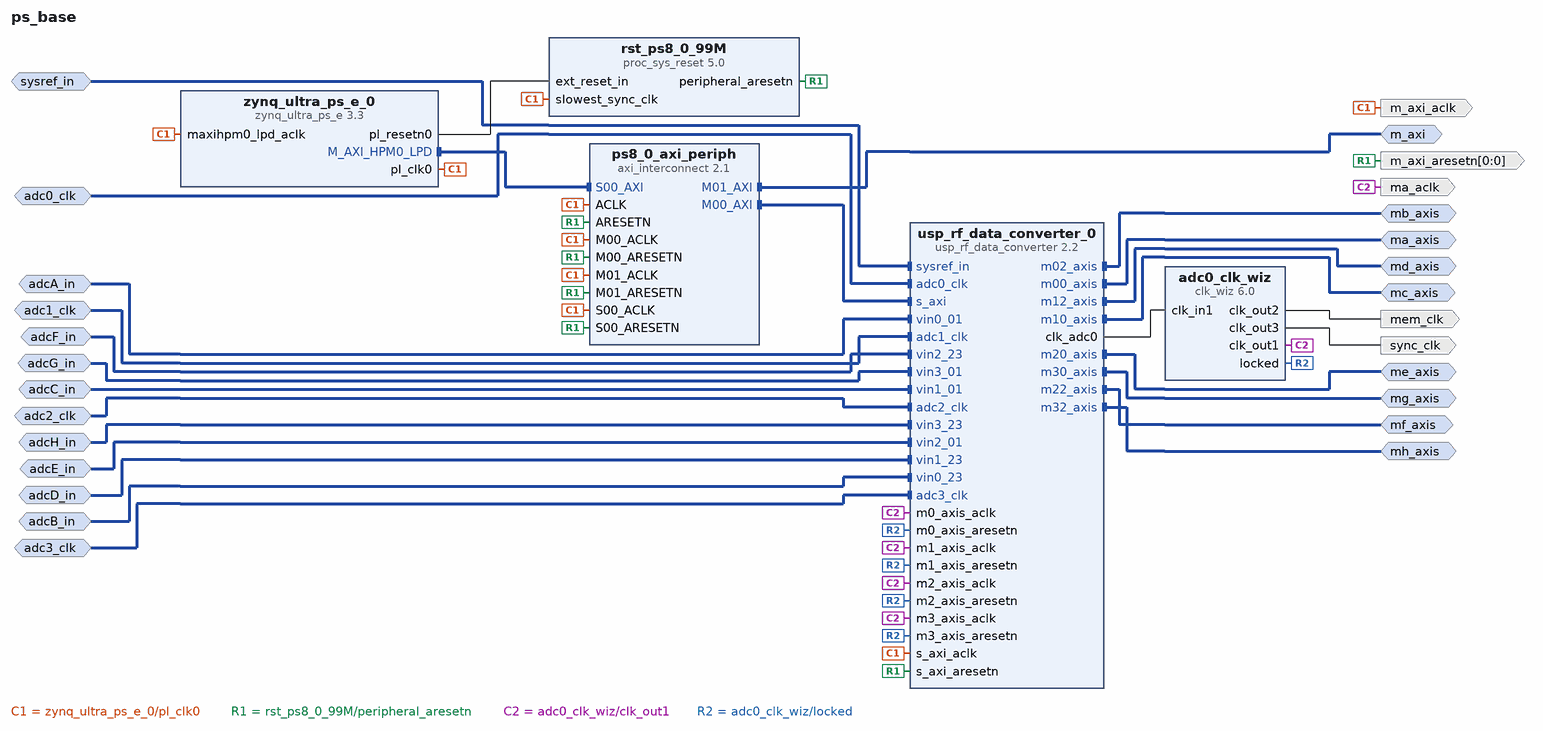
[diagram p0: block diagram of the top level]
# Vivado block design ps_base, xczu25dr-ffve1156-1-e, Vivado 2019.2
create_bd_design ps_base

create_bd_intf_port -mode Slave -vlnv xilinx.com:interface:diff_analog_io_rtl:1.0 adcA_in
create_bd_intf_port -mode Master -vlnv xilinx.com:interface:axis_rtl:1.0 ma_axis
create_bd_intf_port -mode Slave -vlnv xilinx.com:display_usp_rf_data_converter:diff_pins_rtl:1.0 sysref_in
create_bd_intf_port -mode Slave -vlnv xilinx.com:interface:diff_clock_rtl:1.0 adc0_clk
set_property -dict {CONFIG.FREQ_HZ 245760000.0} [get_bd_intf_ports adc0_clk]
create_bd_intf_port -mode Master -vlnv xilinx.com:interface:axis_rtl:1.0 mb_axis
create_bd_intf_port -mode Master -vlnv xilinx.com:interface:axis_rtl:1.0 mc_axis
create_bd_intf_port -mode Master -vlnv xilinx.com:interface:axis_rtl:1.0 md_axis
create_bd_intf_port -mode Master -vlnv xilinx.com:interface:axis_rtl:1.0 me_axis
create_bd_intf_port -mode Master -vlnv xilinx.com:interface:axis_rtl:1.0 mf_axis
create_bd_intf_port -mode Master -vlnv xilinx.com:interface:axis_rtl:1.0 mg_axis
create_bd_intf_port -mode Master -vlnv xilinx.com:interface:axis_rtl:1.0 mh_axis
create_bd_intf_port -mode Slave -vlnv xilinx.com:interface:diff_clock_rtl:1.0 adc1_clk
create_bd_intf_port -mode Slave -vlnv xilinx.com:interface:diff_clock_rtl:1.0 adc2_clk
create_bd_intf_port -mode Slave -vlnv xilinx.com:interface:diff_clock_rtl:1.0 adc3_clk
create_bd_intf_port -mode Slave -vlnv xilinx.com:interface:diff_analog_io_rtl:1.0 adcB_in
create_bd_intf_port -mode Slave -vlnv xilinx.com:interface:diff_analog_io_rtl:1.0 adcC_in
create_bd_intf_port -mode Slave -vlnv xilinx.com:interface:diff_analog_io_rtl:1.0 adcD_in
create_bd_intf_port -mode Slave -vlnv xilinx.com:interface:diff_analog_io_rtl:1.0 adcE_in
create_bd_intf_port -mode Slave -vlnv xilinx.com:interface:diff_analog_io_rtl:1.0 adcF_in
create_bd_intf_port -mode Slave -vlnv xilinx.com:interface:diff_analog_io_rtl:1.0 adcG_in
create_bd_intf_port -mode Slave -vlnv xilinx.com:interface:diff_analog_io_rtl:1.0 adcH_in
create_bd_intf_port -mode Master -vlnv xilinx.com:interface:aximm_rtl:1.0 m_axi
set_property -dict [list \
  CONFIG.DATA_WIDTH 32 \
  CONFIG.PROTOCOL AXI4LITE \
  CONFIG.ADDR_WIDTH 32 \
  CONFIG.HAS_BURST 0 \
  CONFIG.HAS_LOCK 0 \
  CONFIG.HAS_PROT 0 \
  CONFIG.HAS_CACHE 0 \
  CONFIG.HAS_QOS 0 \
  CONFIG.HAS_REGION 0 \
  CONFIG.NUM_READ_OUTSTANDING 1 \
  CONFIG.NUM_WRITE_OUTSTANDING 1 \
] [get_bd_intf_ports m_axi]
create_bd_port -dir O -type clk ma_aclk
set_property -dict [list \
  CONFIG.ASSOCIATED_BUSIF ma_axis:mb_axis:mc_axis:md_axis:me_axis:mf_axis:mg_axis:mh_axis \
] [get_bd_ports ma_aclk]
create_bd_port -dir O -type clk m_axi_aclk
set_property -dict {CONFIG.ASSOCIATED_BUSIF m_axi} [get_bd_ports m_axi_aclk]
create_bd_port -dir O -from 0 -to 0 -type rst m_axi_aresetn
create_bd_port -dir O -type clk mem_clk
set_property -dict {CONFIG.FREQ_HZ 491520000} [get_bd_ports mem_clk]
create_bd_port -dir O -type clk sync_clk
set_property -dict {CONFIG.FREQ_HZ 122880000} [get_bd_ports sync_clk]

create_bd_cell -type ip -vlnv xilinx.com:ip:zynq_ultra_ps_e:3.3 zynq_ultra_ps_e_0
set_property -dict [list \
  CONFIG.PSU_BANK_0_IO_STANDARD LVCMOS18 \
  CONFIG.PSU_BANK_1_IO_STANDARD LVCMOS18 \
  CONFIG.PSU_BANK_2_IO_STANDARD LVCMOS18 \
  CONFIG.PSU_BANK_3_IO_STANDARD LVCMOS18 \
  CONFIG.PSU_USB3__DUAL_CLOCK_ENABLE 1 \
  CONFIG.PSU__CRF_APB__DDR_CTRL__FREQMHZ 1200 \
  CONFIG.PSU__CRL_APB__PL1_REF_CTRL__FREQMHZ 500 \
  CONFIG.PSU__DDRC__DEVICE_CAPACITY {8192 MBits} \
  CONFIG.PSU__DDRC__DRAM_WIDTH {16 Bits} \
  CONFIG.PSU__DDRC__SPEED_BIN DDR4_2400P \
  CONFIG.PSU__DDR_HIGH_ADDRESS_GUI_ENABLE 1 \
  CONFIG.PSU__DDR__INTERFACE__FREQMHZ 600.000 \
  CONFIG.PSU__DLL__ISUSED 1 \
  CONFIG.PSU__ENET3__FIFO__ENABLE 0 \
  CONFIG.PSU__ENET3__GRP_MDIO__ENABLE 1 \
  CONFIG.PSU__ENET3__GRP_MDIO__IO {MIO 76 .. 77} \
  CONFIG.PSU__ENET3__PERIPHERAL__ENABLE 1 \
  CONFIG.PSU__ENET3__PERIPHERAL__IO {MIO 64 .. 75} \
  CONFIG.PSU__ENET3__PTP__ENABLE 0 \
  CONFIG.PSU__ENET3__TSU__ENABLE 0 \
  CONFIG.PSU__FPGA_PL1_ENABLE 1 \
  CONFIG.PSU__GEM3_COHERENCY 0 \
  CONFIG.PSU__GEM3_ROUTE_THROUGH_FPD 0 \
  CONFIG.PSU__GEM__TSU__ENABLE 0 \
  CONFIG.PSU__GPIO0_MIO__IO {MIO 0 .. 25} \
  CONFIG.PSU__GPIO0_MIO__PERIPHERAL__ENABLE 1 \
  CONFIG.PSU__GPIO1_MIO__IO {MIO 26 .. 51} \
  CONFIG.PSU__GPIO1_MIO__PERIPHERAL__ENABLE 1 \
  CONFIG.PSU__GPIO2_MIO__IO {MIO 52 .. 77} \
  CONFIG.PSU__GPIO2_MIO__PERIPHERAL__ENABLE 1 \
  CONFIG.PSU__I2C0__PERIPHERAL__ENABLE 1 \
  CONFIG.PSU__I2C0__PERIPHERAL__IO {MIO 14 .. 15} \
  CONFIG.PSU__I2C1__PERIPHERAL__ENABLE 1 \
  CONFIG.PSU__I2C1__PERIPHERAL__IO {MIO 32 .. 33} \
  CONFIG.PSU__PCIE__BAR0_ENABLE 1 \
  CONFIG.PSU__PCIE__BAR0_SCALE Megabytes \
  CONFIG.PSU__PCIE__BAR0_SIZE 1 \
  CONFIG.PSU__PCIE__BAR0_TYPE Memory \
  CONFIG.PSU__PCIE__BAR0_VAL 0xfff00000 \
  CONFIG.PSU__PCIE__BAR1_VAL 0x0 \
  CONFIG.PSU__PCIE__BAR2_VAL 0x0 \
  CONFIG.PSU__PCIE__BAR3_VAL 0x0 \
  CONFIG.PSU__PCIE__BAR4_VAL 0x0 \
  CONFIG.PSU__PCIE__BAR5_VAL 0x0 \
  CONFIG.PSU__PCIE__BRIDGE_BAR_INDICATOR {BAR 0} \
  CONFIG.PSU__PCIE__CLASS_CODE_BASE 0x05 \
  CONFIG.PSU__PCIE__CLASS_CODE_INTERFACE 0x0 \
  CONFIG.PSU__PCIE__CLASS_CODE_SUB 0x80 \
  CONFIG.PSU__PCIE__CLASS_CODE_VALUE 0x58000 \
  CONFIG.PSU__PCIE__DEVICE_ID 0xD011 \
  CONFIG.PSU__PCIE__DEVICE_PORT_TYPE {Endpoint Device} \
  CONFIG.PSU__PCIE__EROM_VAL 0x0 \
  CONFIG.PSU__PCIE__INTX_GENERATION 1 \
  CONFIG.PSU__PCIE__INTX_PIN INTA \
  CONFIG.PSU__PCIE__LANE0__ENABLE 1 \
  CONFIG.PSU__PCIE__LANE0__IO {GT Lane0} \
  CONFIG.PSU__PCIE__LANE1__ENABLE 1 \
  CONFIG.PSU__PCIE__LANE1__IO {GT Lane1} \
  CONFIG.PSU__PCIE__LANE2__ENABLE 1 \
  CONFIG.PSU__PCIE__LANE2__IO {GT Lane2} \
  CONFIG.PSU__PCIE__LANE3__ENABLE 1 \
  CONFIG.PSU__PCIE__LANE3__IO {GT Lane3} \
  CONFIG.PSU__PCIE__LINK_SPEED {5.0 Gb/s} \
  CONFIG.PSU__PCIE__MAXIMUM_LINK_WIDTH x4 \
  CONFIG.PSU__PCIE__MAX_PAYLOAD_SIZE {256 bytes} \
  CONFIG.PSU__PCIE__MSIX_BAR_INDICATOR {BAR 0} \
  CONFIG.PSU__PCIE__MSIX_PBA_BAR_INDICATOR {BAR 0} \
  CONFIG.PSU__PCIE__PERIPHERAL__ENABLE 1 \
  CONFIG.PSU__PCIE__PERIPHERAL__ENDPOINT_IO {MIO 35} \
  CONFIG.PSU__PCIE__REF_CLK_FREQ 100 \
  CONFIG.PSU__PCIE__REF_CLK_SEL {Ref Clk0} \
  CONFIG.PSU__PCIE__REVISION_ID 0x0 \
  CONFIG.PSU__PCIE__SUBSYSTEM_ID 0x7 \
  CONFIG.PSU__PCIE__SUBSYSTEM_VENDOR_ID 0x10EE \
  CONFIG.PSU__PCIE__VENDOR_ID 0x10EE \
  CONFIG.PSU__PRESET_APPLIED 1 \
  CONFIG.PSU__PSS_REF_CLK__FREQMHZ 33.333333 \
  CONFIG.PSU__QSPI_COHERENCY 0 \
  CONFIG.PSU__QSPI_ROUTE_THROUGH_FPD 0 \
  CONFIG.PSU__QSPI__GRP_FBCLK__ENABLE 1 \
  CONFIG.PSU__QSPI__GRP_FBCLK__IO {MIO 6} \
  CONFIG.PSU__QSPI__PERIPHERAL__DATA_MODE x4 \
  CONFIG.PSU__QSPI__PERIPHERAL__ENABLE 1 \
  CONFIG.PSU__QSPI__PERIPHERAL__IO {MIO 0 .. 12} \
  CONFIG.PSU__QSPI__PERIPHERAL__MODE {Dual Parallel} \
  CONFIG.PSU__SD1_COHERENCY 0 \
  CONFIG.PSU__SD1_ROUTE_THROUGH_FPD 0 \
  CONFIG.PSU__SD1__DATA_TRANSFER_MODE 4Bit \
  CONFIG.PSU__SD1__GRP_CD__ENABLE 0 \
  CONFIG.PSU__SD1__GRP_POW__ENABLE 0 \
  CONFIG.PSU__SD1__GRP_WP__ENABLE 0 \
  CONFIG.PSU__SD1__PERIPHERAL__ENABLE 1 \
  CONFIG.PSU__SD1__PERIPHERAL__IO {MIO 46 .. 51} \
  CONFIG.PSU__SD1__SLOT_TYPE {SD 2.0} \
  CONFIG.PSU__SWDT0__CLOCK__ENABLE 0 \
  CONFIG.PSU__SWDT0__PERIPHERAL__ENABLE 1 \
  CONFIG.PSU__SWDT0__RESET__ENABLE 0 \
  CONFIG.PSU__SWDT1__CLOCK__ENABLE 0 \
  CONFIG.PSU__SWDT1__PERIPHERAL__ENABLE 1 \
  CONFIG.PSU__SWDT1__RESET__ENABLE 0 \
  CONFIG.PSU__TSU__BUFG_PORT_PAIR 0 \
  CONFIG.PSU__TTC0__CLOCK__ENABLE 0 \
  CONFIG.PSU__TTC0__PERIPHERAL__ENABLE 1 \
  CONFIG.PSU__TTC0__WAVEOUT__ENABLE 0 \
  CONFIG.PSU__TTC1__CLOCK__ENABLE 0 \
  CONFIG.PSU__TTC1__PERIPHERAL__ENABLE 1 \
  CONFIG.PSU__TTC1__WAVEOUT__ENABLE 0 \
  CONFIG.PSU__TTC2__CLOCK__ENABLE 0 \
  CONFIG.PSU__TTC2__PERIPHERAL__ENABLE 1 \
  CONFIG.PSU__TTC2__WAVEOUT__ENABLE 0 \
  CONFIG.PSU__TTC3__CLOCK__ENABLE 0 \
  CONFIG.PSU__TTC3__PERIPHERAL__ENABLE 1 \
  CONFIG.PSU__TTC3__WAVEOUT__ENABLE 0 \
  CONFIG.PSU__UART0__BAUD_RATE 115200 \
  CONFIG.PSU__UART0__MODEM__ENABLE 0 \
  CONFIG.PSU__UART0__PERIPHERAL__ENABLE 1 \
  CONFIG.PSU__UART0__PERIPHERAL__IO {MIO 42 .. 43} \
  CONFIG.PSU__USB0_COHERENCY 0 \
  CONFIG.PSU__USB0__PERIPHERAL__ENABLE 1 \
  CONFIG.PSU__USB0__PERIPHERAL__IO {MIO 52 .. 63} \
  CONFIG.PSU__USB2_0__EMIO__ENABLE 0 \
  CONFIG.PSU__USB3_0__PERIPHERAL__ENABLE 0 \
  CONFIG.PSU__USB__RESET__MODE {Boot Pin} \
  CONFIG.PSU__USB__RESET__POLARITY {Active Low} \
  CONFIG.PSU__USE__M_AXI_GP2 1 \
  CONFIG.SUBPRESET1 Custom \
] [get_bd_cells zynq_ultra_ps_e_0]
# 114 more settings of zynq_ultra_ps_e_0 are not shown: defaults, MIO pin electricals, DDR timing, and values the tool derives
create_bd_cell -type ip -vlnv xilinx.com:ip:usp_rf_data_converter:2.2 usp_rf_data_converter_0
set_property -dict [list \
  CONFIG.ADC0_Outclk_Freq 184.320 \
  CONFIG.ADC0_PLL_Enable true \
  CONFIG.ADC0_Refclk_Freq 245.760 \
  CONFIG.ADC0_Sampling_Rate 2.94912 \
  CONFIG.ADC1_Outclk_Freq 184.320 \
  CONFIG.ADC1_PLL_Enable true \
  CONFIG.ADC1_Refclk_Div 1 \
  CONFIG.ADC1_Refclk_Freq 245.760 \
  CONFIG.ADC1_Sampling_Rate 2.94912 \
  CONFIG.ADC2_Outclk_Freq 184.320 \
  CONFIG.ADC2_PLL_Enable true \
  CONFIG.ADC2_Refclk_Freq 245.760 \
  CONFIG.ADC2_Sampling_Rate 2.94912 \
  CONFIG.ADC3_Outclk_Freq 184.320 \
  CONFIG.ADC3_PLL_Enable true \
  CONFIG.ADC3_Refclk_Freq 245.760 \
  CONFIG.ADC3_Sampling_Rate 2.94912 \
  CONFIG.ADC_Decimation_Mode00 1 \
  CONFIG.ADC_Decimation_Mode02 1 \
  CONFIG.ADC_Decimation_Mode10 1 \
  CONFIG.ADC_Decimation_Mode12 1 \
  CONFIG.ADC_Decimation_Mode20 1 \
  CONFIG.ADC_Decimation_Mode22 1 \
  CONFIG.ADC_Decimation_Mode30 1 \
  CONFIG.ADC_Decimation_Mode32 1 \
  CONFIG.ADC_Dither00 false \
  CONFIG.ADC_Dither02 false \
  CONFIG.ADC_Dither10 false \
  CONFIG.ADC_Dither12 false \
  CONFIG.ADC_Dither20 false \
  CONFIG.ADC_Dither22 false \
  CONFIG.ADC_Dither30 false \
  CONFIG.ADC_Dither32 false \
  CONFIG.ADC_Mixer_Type00 0 \
  CONFIG.ADC_Mixer_Type01 0 \
  CONFIG.ADC_Mixer_Type02 0 \
  CONFIG.ADC_Mixer_Type03 0 \
  CONFIG.ADC_Mixer_Type10 0 \
  CONFIG.ADC_Mixer_Type11 0 \
  CONFIG.ADC_Mixer_Type12 0 \
  CONFIG.ADC_Mixer_Type13 0 \
  CONFIG.ADC_Mixer_Type20 0 \
  CONFIG.ADC_Mixer_Type21 0 \
  CONFIG.ADC_Mixer_Type22 0 \
  CONFIG.ADC_Mixer_Type23 0 \
  CONFIG.ADC_Mixer_Type30 0 \
  CONFIG.ADC_Mixer_Type31 0 \
  CONFIG.ADC_Mixer_Type32 0 \
  CONFIG.ADC_Mixer_Type33 0 \
  CONFIG.ADC_Slice00_Enable true \
  CONFIG.ADC_Slice02_Enable true \
  CONFIG.ADC_Slice10_Enable true \
  CONFIG.ADC_Slice12_Enable true \
  CONFIG.ADC_Slice20_Enable true \
  CONFIG.ADC_Slice22_Enable true \
  CONFIG.ADC_Slice30_Enable true \
  CONFIG.ADC_Slice32_Enable true \
  CONFIG.Converter_Setup 1 \
] [get_bd_cells usp_rf_data_converter_0]
create_bd_cell -type ip -vlnv xilinx.com:ip:axi_interconnect:2.1 ps8_0_axi_periph
set_property -dict {CONFIG.NUM_MI 2} [get_bd_cells ps8_0_axi_periph]
create_bd_cell -type ip -vlnv xilinx.com:ip:proc_sys_reset:5.0 rst_ps8_0_99M
create_bd_cell -type ip -vlnv xilinx.com:ip:clk_wiz:6.0 adc0_clk_wiz
set_property -dict [list \
  CONFIG.CLKOUT1_JITTER 75.562 \
  CONFIG.CLKOUT1_MATCHED_ROUTING true \
  CONFIG.CLKOUT1_PHASE_ERROR 74.806 \
  CONFIG.CLKOUT1_REQUESTED_OUT_FREQ 368.640 \
  CONFIG.CLKOUT2_JITTER 71.572 \
  CONFIG.CLKOUT2_MATCHED_ROUTING true \
  CONFIG.CLKOUT2_PHASE_ERROR 74.806 \
  CONFIG.CLKOUT2_REQUESTED_OUT_FREQ 491.52 \
  CONFIG.CLKOUT2_USED true \
  CONFIG.CLKOUT3_JITTER 93.037 \
  CONFIG.CLKOUT3_PHASE_ERROR 74.806 \
  CONFIG.CLKOUT3_REQUESTED_OUT_FREQ 122.88 \
  CONFIG.CLKOUT3_USED true \
  CONFIG.MMCM_CLKFBOUT_MULT_F 8.000 \
  CONFIG.MMCM_CLKOUT0_DIVIDE_F 4.000 \
  CONFIG.MMCM_CLKOUT1_DIVIDE 3 \
  CONFIG.MMCM_CLKOUT2_DIVIDE 12 \
  CONFIG.NUM_OUT_CLKS 3 \
  CONFIG.PRIM_IN_FREQ 184.320 \
] [get_bd_cells adc0_clk_wiz]

# ---- connections ----

connect_bd_intf_net [get_bd_intf_pins ps8_0_axi_periph/M00_AXI] [get_bd_intf_pins usp_rf_data_converter_0/s_axi]
connect_bd_intf_net [get_bd_intf_ports md_axis] [get_bd_intf_pins usp_rf_data_converter_0/m12_axis]
connect_bd_intf_net [get_bd_intf_ports mb_axis] [get_bd_intf_pins usp_rf_data_converter_0/m02_axis]
connect_bd_intf_net [get_bd_intf_ports mg_axis] [get_bd_intf_pins usp_rf_data_converter_0/m30_axis]
connect_bd_intf_net [get_bd_intf_ports mh_axis] [get_bd_intf_pins usp_rf_data_converter_0/m32_axis]
connect_bd_intf_net [get_bd_intf_ports sysref_in] [get_bd_intf_pins usp_rf_data_converter_0/sysref_in]
connect_bd_intf_net [get_bd_intf_ports ma_axis] [get_bd_intf_pins usp_rf_data_converter_0/m00_axis]
connect_bd_intf_net [get_bd_intf_ports adc0_clk] [get_bd_intf_pins usp_rf_data_converter_0/adc0_clk]
connect_bd_intf_net -intf_net vin0_01_0_1 [get_bd_intf_ports adcA_in] [get_bd_intf_pins usp_rf_data_converter_0/vin0_01]
connect_bd_intf_net [get_bd_intf_ports mf_axis] [get_bd_intf_pins usp_rf_data_converter_0/m22_axis]
connect_bd_intf_net -intf_net adc1_clk_0_1 [get_bd_intf_ports adc1_clk] [get_bd_intf_pins usp_rf_data_converter_0/adc1_clk]
connect_bd_intf_net [get_bd_intf_pins zynq_ultra_ps_e_0/M_AXI_HPM0_LPD] [get_bd_intf_pins ps8_0_axi_periph/S00_AXI]
connect_bd_intf_net -intf_net vin2_23_0_1 [get_bd_intf_ports adcF_in] [get_bd_intf_pins usp_rf_data_converter_0/vin2_23]
connect_bd_intf_net [get_bd_intf_ports me_axis] [get_bd_intf_pins usp_rf_data_converter_0/m20_axis]
connect_bd_intf_net [get_bd_intf_ports mc_axis] [get_bd_intf_pins usp_rf_data_converter_0/m10_axis]
connect_bd_intf_net -intf_net vin3_01_0_1 [get_bd_intf_ports adcG_in] [get_bd_intf_pins usp_rf_data_converter_0/vin3_01]
connect_bd_intf_net -intf_net vin1_01_0_1 [get_bd_intf_ports adcC_in] [get_bd_intf_pins usp_rf_data_converter_0/vin1_01]
connect_bd_intf_net -intf_net adc2_clk_0_1 [get_bd_intf_ports adc2_clk] [get_bd_intf_pins usp_rf_data_converter_0/adc2_clk]
connect_bd_intf_net -intf_net vin3_23_0_1 [get_bd_intf_ports adcH_in] [get_bd_intf_pins usp_rf_data_converter_0/vin3_23]
connect_bd_intf_net [get_bd_intf_ports m_axi] [get_bd_intf_pins ps8_0_axi_periph/M01_AXI]
connect_bd_intf_net -intf_net vin2_01_0_1 [get_bd_intf_ports adcE_in] [get_bd_intf_pins usp_rf_data_converter_0/vin2_01]
connect_bd_intf_net -intf_net vin1_23_0_1 [get_bd_intf_ports adcD_in] [get_bd_intf_pins usp_rf_data_converter_0/vin1_23]
connect_bd_intf_net -intf_net vin0_23_0_1 [get_bd_intf_ports adcB_in] [get_bd_intf_pins usp_rf_data_converter_0/vin0_23]
connect_bd_intf_net -intf_net adc3_clk_0_1 [get_bd_intf_ports adc3_clk] [get_bd_intf_pins usp_rf_data_converter_0/adc3_clk]
connect_bd_net [get_bd_pins zynq_ultra_ps_e_0/pl_clk0] \
  [get_bd_pins zynq_ultra_ps_e_0/maxihpm0_lpd_aclk] [get_bd_pins ps8_0_axi_periph/S00_ACLK] \
  [get_bd_pins rst_ps8_0_99M/slowest_sync_clk] [get_bd_pins usp_rf_data_converter_0/s_axi_aclk] \
  [get_bd_pins ps8_0_axi_periph/M00_ACLK] [get_bd_pins ps8_0_axi_periph/ACLK] [get_bd_ports m_axi_aclk] \
  [get_bd_pins ps8_0_axi_periph/M01_ACLK]
connect_bd_net [get_bd_pins zynq_ultra_ps_e_0/pl_resetn0] [get_bd_pins rst_ps8_0_99M/ext_reset_in]
connect_bd_net [get_bd_pins rst_ps8_0_99M/peripheral_aresetn] \
  [get_bd_pins ps8_0_axi_periph/S00_ARESETN] [get_bd_pins usp_rf_data_converter_0/s_axi_aresetn] \
  [get_bd_pins ps8_0_axi_periph/M00_ARESETN] [get_bd_pins ps8_0_axi_periph/ARESETN] [get_bd_ports m_axi_aresetn] \
  [get_bd_pins ps8_0_axi_periph/M01_ARESETN]
connect_bd_net [get_bd_pins adc0_clk_wiz/clk_out1] \
  [get_bd_pins usp_rf_data_converter_0/m0_axis_aclk] [get_bd_ports ma_aclk] \
  [get_bd_pins usp_rf_data_converter_0/m1_axis_aclk] [get_bd_pins usp_rf_data_converter_0/m2_axis_aclk] \
  [get_bd_pins usp_rf_data_converter_0/m3_axis_aclk]
connect_bd_net [get_bd_pins usp_rf_data_converter_0/clk_adc0] [get_bd_pins adc0_clk_wiz/clk_in1]
connect_bd_net [get_bd_pins adc0_clk_wiz/locked] \
  [get_bd_pins usp_rf_data_converter_0/m0_axis_aresetn] [get_bd_pins usp_rf_data_converter_0/m1_axis_aresetn] \
  [get_bd_pins usp_rf_data_converter_0/m2_axis_aresetn] [get_bd_pins usp_rf_data_converter_0/m3_axis_aresetn]
connect_bd_net [get_bd_pins adc0_clk_wiz/clk_out2] [get_bd_ports mem_clk]
connect_bd_net [get_bd_pins adc0_clk_wiz/clk_out3] [get_bd_ports sync_clk]

# ---- address map ----
assign_bd_address -offset 0x0080000000 -range 256K -target_address_space [get_bd_addr_spaces zynq_ultra_ps_e_0/Data] [get_bd_addr_segs usp_rf_data_converter_0/s_axi/Reg]
assign_bd_address -offset 0x0080100000 -range 1M -target_address_space [get_bd_addr_spaces zynq_ultra_ps_e_0/Data] [get_bd_addr_segs m_axi/Reg]

validate_bd_design
save_bd_design
